# Altium schematic sheet 4_BUTTONS.SchDoc
size A; SheetNumber: 9; SheetTotal: 9
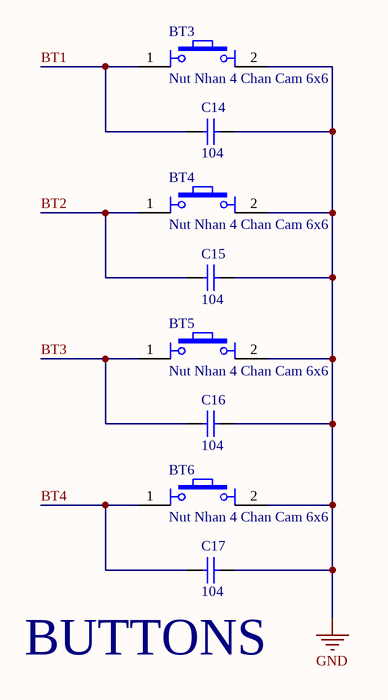
[diagram p0: 4_BUTTONS.SchDoc]

## Parts
BT3  Nut Nhan 4 Chan Cam 6x6  [Nut Nhan 4 Chan Cam 6x6]
BT4  Nut Nhan 4 Chan Cam 6x6  [Nut Nhan 4 Chan Cam 6x6]
BT5  Nut Nhan 4 Chan Cam 6x6  [Nut Nhan 4 Chan Cam 6x6]
BT6  Nut Nhan 4 Chan Cam 6x6  [Nut Nhan 4 Chan Cam 6x6]
C14  104  [tu 0603]
C15  104  [tu 0603]
C16  104  [tu 0603]
C17  104  [tu 0603]

## Nets
GND: BT3.2 BT4.2 BT5.2 BT6.2 C14.2 C15.2 C16.2 C17.2
BT1: BT3.1 C14.1
BT2: BT4.1 C15.1
BT3: BT5.1 C16.1
BT4: BT6.1 C17.1

## Notes on the sheet
- (near C17) BUTTONS

## Library data of the parts
BT3-BT6 = Nut Nhan 4 Chan Cam 6x6: Nut Nhan 4 Chan 6x6mm; Ten: Nút Nhấn 4 Chân 6x6x5MM DIP; Ma_Hang: MH004584
C14-C17 = Tu 0603 104 50V 10%: Dán; Don_Vi: Con; So_Chan: 2; Ten_Linh_Kien: Tụ 0603 104-100nF 10% 50V; Ma_Hang: MH004568; Chung_Loai: Dán; Kieu_Chan: *